# Altium schematic sheet AQ_Schematic.SchDoc
size A; SheetNumber: 1; SheetTotal: 2
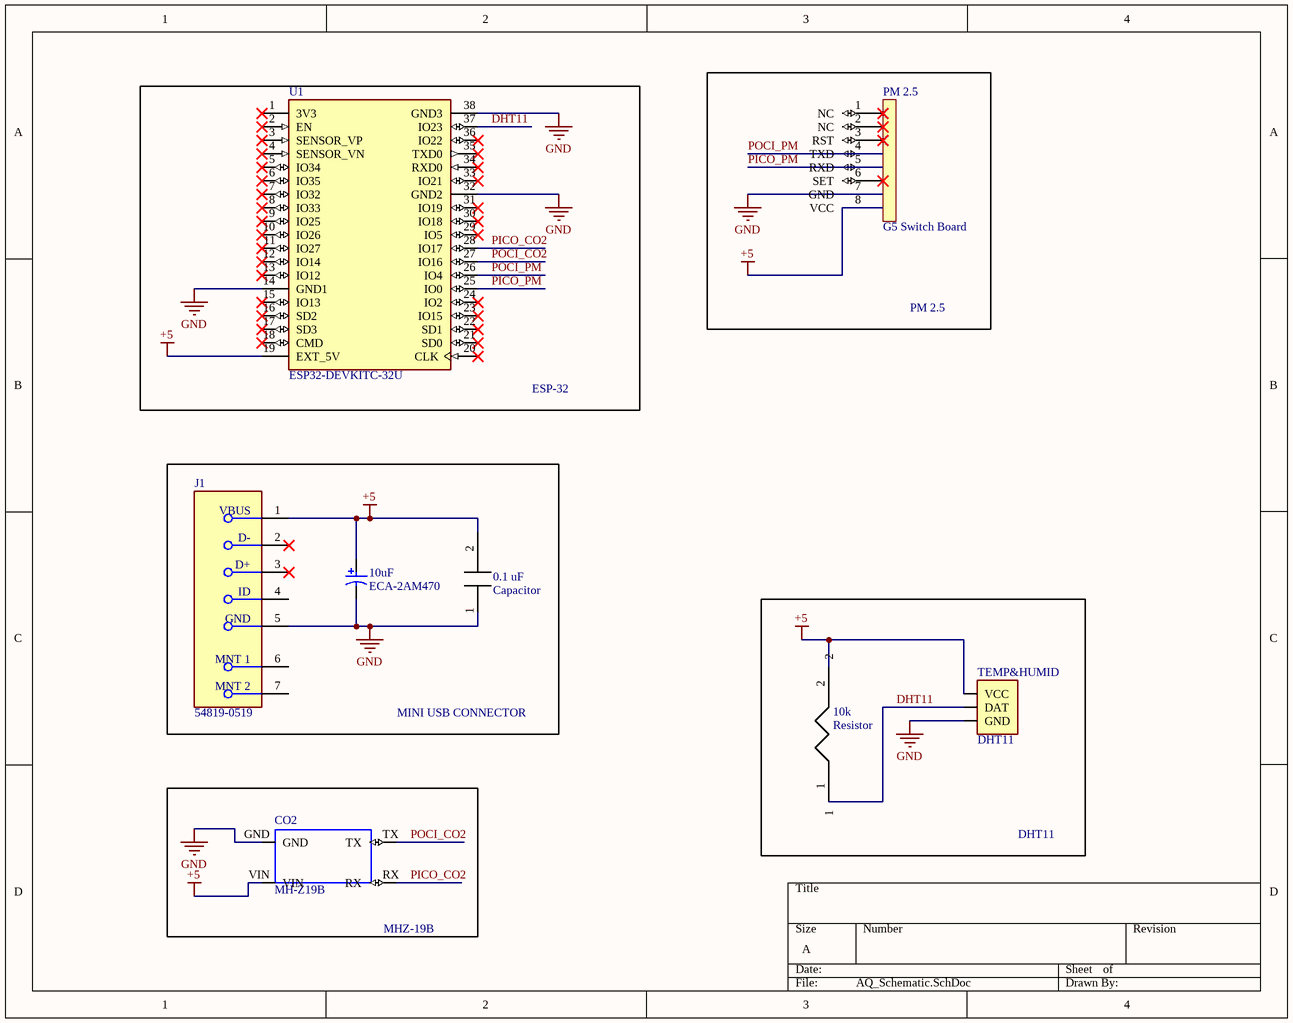
[diagram p0: AQ_Schematic.SchDoc]

## Parts
0.1_uF  Capacitor  [PCBComponent_1]
10k  Resistor  [Resistor]
10uF  ECA-2AM470  [CAPPR65-350-1150X800X1250]
CO2  MH-Z19B  [MH-Z19B-FOOT]
J1  54819-0519  [FP-54819-0519-MFG]
PM_2.5  G5 Switch Board  [PM2.5]
TEMP&HUMID  DHT11  [SENSOR-DHT11]
U1  ESP32-DEVKITC-32U  [MODULE_ESP32-DEVKITC-32U]

## Blocks framed on the sheet
PM 2.5: PM_2.5
ESP-32: U1
MINI USB CONNECTOR: 0.1_uF 10uF J1
DHT11: 10k TEMP&HUMID
MHZ-19B: CO2

## Nets
+5: 10uF.1 CO2.VIN J1.1(VBUS) PM_2.5.8(VCC) TEMP&HUMID.P$1(VCC) U1.19(EXT_5V)
GND: 10uF.2 CO2.GND J1.5(GND) PM_2.5.7(GND) TEMP&HUMID.P$4(GND) U1.14(GND1) U1.32(GND2) U1.38(GND3)
DHT11: TEMP&HUMID.P$2(DAT) U1.37(IO23)
PICO_CO2: CO2.RX U1.28(IO17)
PICO_PM: PM_2.5.5(RXD) U1.25(IO0)
POCI_CO2: CO2.TX U1.27(IO16)
POCI_PM: PM_2.5.4(TXD) U1.26(IO4)

Not connected (* = marked no-connect by the designer): 0.1_uF 1 2; 10k 1 2; J1 2(D-)* 3(D+)* 4(ID) 6(MNT_1) 7(MNT_2); PM_2.5 1(NC)* 2(NC)* 3(RST)* 6(SET)*; U1 1(3V3)* 2(EN)* 3(SENSOR_VP)* 4(SENSOR_VN)* 5(IO34)* 6(IO35)* 7(IO32)* 8(IO33)* 9(IO25)* 10(IO26)* 11(IO27)* 12(IO14)* 13(IO12)* 15(IO13)* 16(SD2)* 17(SD3)* 18(CMD)* 20(CLK)* 21(SD0)* 22(SD1)* 23(IO15)* 24(IO2)* 29(IO5)* 30(IO18)* 31(IO19)* 33(IO21)* 34(RXD0)* 35(TXD0)* 36(IO22)*

## Library data of the parts
10uF = CMP-1665-00041-1: Aluminum Electrolytic Capacitor, 47 uF, +/- 20%, 100 V, -40 to 85 degC, 2-Pin THD, RoHS, Bulk; Data Rate: 54 mbps; Nominal Supply Voltage: 3.3 V; Case\Package: QFN; ComponentLink1URL: http://www.panasonic.com/; Packaging: Tape and Reel; PackageDescription: 2-Pin Radial Lead, Dia 8 mm, Body Length 11.5 mm; PackageReference: CAPPR65-350-1150X800X1250; ComponentLink2Description: Datasheet; Max Operating Temperature: 70 degC; ComponentLink2URL: http://industrial.panasonic.com/cdbs/www-data/pdf/RDF0000/ABA0000C1047.pdf; RoHSCompliant: true; Length: 7.7 mm; Min Operating Temperature: -20 degC; DatasheetVersion: Mar-16; Mount: Surface Mount; Pins: 48; Radiation Hardening: No; Package Quantity: 500; ComponentLink1Description: Manufacturer URL
CO2 = MH-Z19B: Intelligent Infrared CO2 Module; MF: Winsen; MP: MH-Z19B; Availability: Not in stock; Check_prices: https://www.snapeda.com/parts/MH-Z19B/Winsen/view-part/?ref=eda; Package: Package; Value: *; SnapEDA_Link: https://www.snapeda.com/parts/MH-Z19B/Winsen/view-part/?ref=snap; Price: None
J1 = CMP-04767-000009-1: CONN RCPT USB2.0 MINI B 5P R/A; Number of Circuits: 5; Max Current Rating: 1A; Pitch: 0.8mm; Contact Resistance: 50mR; Data Rate: 480Mbps; Gender: Receptacle; Number of Ports: 1; Connector Type: USB; Working Voltage: 30V; Insulation Resistance: 100MR; Number of Rows: 1; Series: 54819; USB Standard: USB 2.0; Contact Plating: Gold; Min Operating Temperature: 0°C; Radiation Hardening: No; Current Rating: 1A; Number of Terminals/Pins: 5; Number of Positions: 5; Packaging: Tray; Termination: Solder; Orientation: Right Angle; Flammability Rating: UL94 V-0; Package Quantity: 3600; Number of Contacts: 5; Lead Free: Lead Free; Max Operating Temperature: 50°C; Color: Black; Housing Color: Black; Contact Material: Copper Alloy; Width: 6.9mm; Length: 7.7mm; Housing Material: Polyamide; Features: Shielded; Mount: Through Hole; Voltage Rating: 30V; Depth: 9mm; Voltage Rating (DC): 30V
TEMP&HUMID = DHT11: Humidity, Temperature Digital Â±5% RH Through Hole; MF: UNIVERSAL-SOLDER Electronics Ltd; SnapEDA_Link: https://www.snapeda.com/parts/DHT11/Ersa/view-part/?ref=snap; Package: None; Value: *; MP: DHT11; Check_prices: https://www.snapeda.com/parts/DHT11/Ersa/view-part/?ref=eda
U1 = ESP32-DEVKITC-32U: ESP32-WROOM-32UE series Transceiver; 802.11 b/g/n (Wi-Fi, WiFi, WLAN), Bluetooth® Smart Ready 4.x Dual Mode Evaluation Board; MF: Espressif Systems; SnapEDA_Link: https://www.snapeda.com/parts/ESP32-DEVKITC-32U/Espressif+Systems/view-part/?ref=snap; Package: CUSTOM-38 ESPRESSIF; Value: *; MP: ESP32-DEVKITC-32U; Check_prices: https://www.snapeda.com/parts/ESP32-DEVKITC-32U/Espressif+Systems/view-part/?ref=eda